# EAGLE design amc7135-20mm-dia-350mA-led-driver-mk-1.0 (EAGLE 6.5.0)
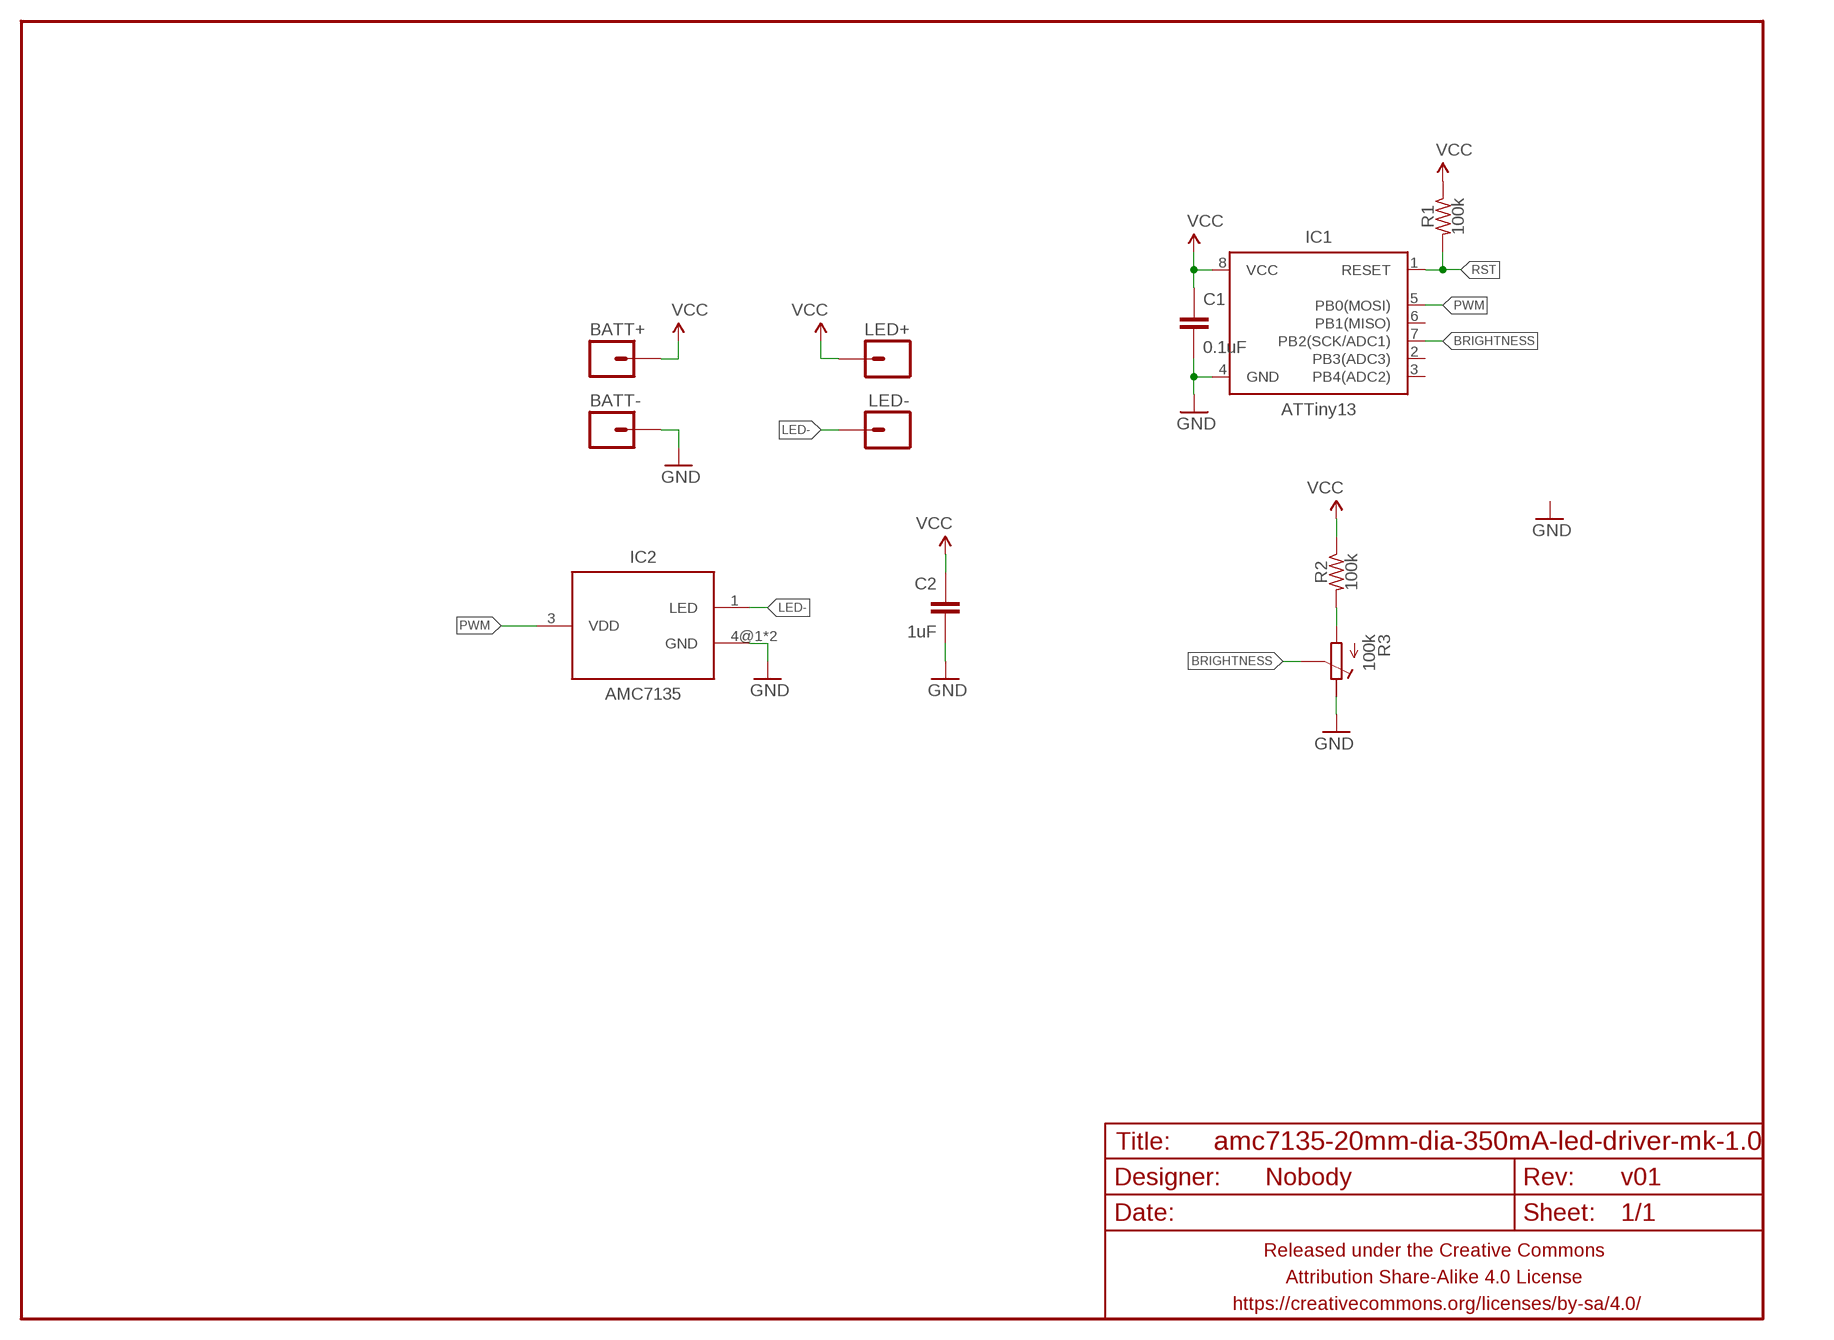
[diagram p0: schematic, sheet 1]

## Parts
BATT+  M01NOT-A-VIA-NOPE  [1X01_NOSILK_NOSTOP]
BATT-  M01NOT-A-VIA-NOPE  [1X01_NOSILK_NOSTOP]
C1  0.1uF  CAPACITOR-CERAMICC0805  [C0805]
C2  1uF  CAPACITOR-CERAMICC1206  [C1206]
FRAME1  FRAME-LETTERNO_PACKAGE  [DUMMY]
IC1  ATTiny13  ATTINY13SOIC  [SO08]
IC2  AMC7135  AMC7135SOT-89-NOTHERM  [SOT89-NOTHERM]
LED+  M01PTH-1.2MM  [1X01-1.2MM]
LED-  M01PTH-1.2MM-NS  [1X01-1.2MM-NS]
R1  100k  RESISTORR0805  [R0805]
R2  100k  RESISTORR0805  [R0805]
R3  100k  POTENTIOMETEREVM3Y  [EVM3Y]

## Nets
BRIGHTNESS: IC1.7(PB2(SCK/ADC1)) R3.S
GND: BATT-.P$1 C1.2 C2.2 IC1.4(GND) IC2.4@1(GND) IC2.4@2(GND) R3.E
LED-: IC2.1(LED) LED-.P$1
N$1: R2.2 R3.A
PWM: IC1.5(PB0(MOSI)) IC2.3(VDD)
RST: IC1.1(RESET) R1.2
VCC: BATT+.P$1 C1.1 C2.1 IC1.8(VCC) LED+.P$1 R1.1 R2.1
Unconnected: IC1.2(PB3(ADC3)) IC1.3(PB4(ADC2)) IC1.6(PB1(MISO))

## Library data of the parts
BATT+ BATT- LED+ LED- = A_butts:M01: Header 1 Standard 1-pin 0.1" header. Use with straight break away headers (SKU : PRT-00116), right angle break away headers (PRT-00553), swiss pins (PRT-00743), machine pins (PRT-00117), and female headers (PRT-00115).
C1 C2 = A_butts:CAPACITOR-CERAMIC: CAPACITOR, European symbol
FRAME1 = A_butts:FRAME-LETTER: Schematic Frame Standard 8.5x11 US Letter frame; DESIGNER: Nobody; VERSION: v01
IC1 = A_butts:ATTINY13: Atmel 8-pin 1kB flash uC
IC2 = A_butts:AMC7135
R1 R2 = A_butts:RESISTOR: RESISTOR, American symbol
R3 = A_butts:POTENTIOMETER: Trimm resistor

## Board
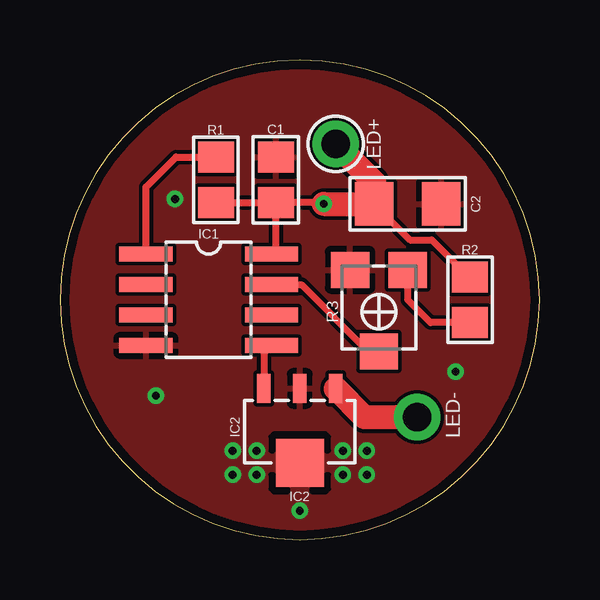
[diagram p1: board, top side]
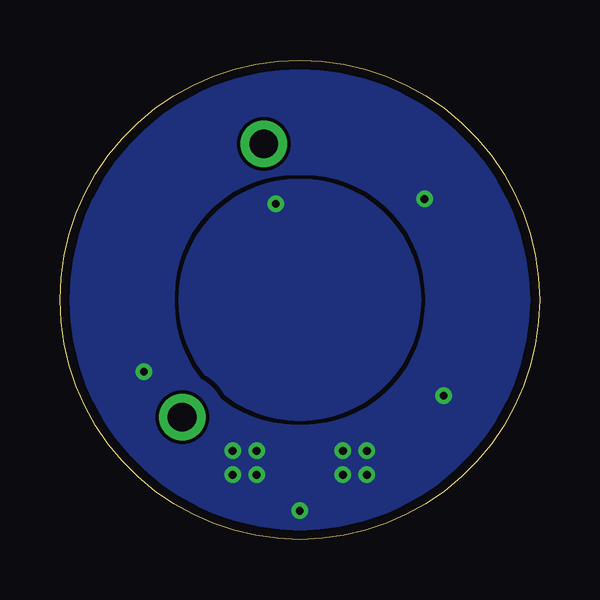
[diagram p2: board, bottom side, seen from below]

Size 20 x 20 mm. Coordinates in mm from the lower left corner, seen from the top.
Outline: 0,10 arc90 10,0 arc90 20,10 arc90 10,20 arc90 0,10
Copper layers (1*16): Top 0.0356mm / dielectric 1.5011mm / Bottom 0.0356mm
Design rules "LaenPCBOrder2": minimum track width 6mil, minimum drill 13mil, track to track 6mil, track to pad 6mil, pad to pad 6mil, via to via 6mil, smd to smd 6mil, copper to edge 15mil, drill to drill 6mil, minimum pad ring 7mil, minimum via ring 7mil, stop-mask expansion 3mil, vias tented up to drill 20mil, thermal gap 10mil
tRestrict: area 8.9,4.3 to 11.1,4.4; area 8.8,3.7 to 8.9,4.3; area 11.1,3.7 to 11.2,4.3; area 8.8,2.1 to 8.9,2.7; area 11.1,2.1 to 11.2,2.7; area 8.9,2 to 9.5,2.1; area 10.5,2 to 11.1,2.1

### Footprints (pad centres in the part's own frame; a part is rotated, then mirrored left to right if it is on the bottom)
1X01_NOSILK_NOSTOP = drill 0.33: P$1 0,0
C0805 = smd 1.3 x 1.5: 1 -0.95,0; 2 0.95,0
C1206 = smd 1.6 x 1.8: 1 -1.4,0; 2 1.4,0
SO08 = smd 0.61 x 2.21: 1 -1.905,-2.616; 2 -0.635,-2.616; 3 0.635,-2.616; 4 1.905,-2.616; 5 1.905,2.616; 6 0.635,2.616; 7 -0.635,2.616; 8 -1.905,2.616
SOT89-NOTHERM = smd 0.58 x 1.2: 1 -1.5,-1.8; 3 1.5,-1.8; 4@1 0,-1.8 | smd 2 x 2: 4@2 0,1.3
1X01-1.2MM = drill 1.2 pad 1.93: P$1 0,0
1X01-1.2MM-NS = drill 1.2 pad 1.93: P$1 0,0
R0805 = smd 1.3 x 1.5: 1 -0.95,0; 2 0.95,0
EVM3Y = smd 1.6 x 1.5: A -1.2,-1.75; E 1.2,-1.75; S 0,1.65

### Placement (x,y rotation side)
BATT+  11,14 0 top
BATT-  4.8,14.2 0 top
C1  9,15 90 top
C2  14.5,14 0 top
FRAME1  0,0 0 top
IC1  6.2,10 270 top
IC2  10,4.5 180 top
LED+  11.5,16.5 270 top
LED-  14.9,5.1 270 top
R1  6.5,15 90 top
R2  17.1,10 270 top
R3  13.3,9.5 180 top

### Tracks (layer width: path | path; a pad name or v marks a point on that pad's centre or on a via)
BRIGHTNESS
  Top 0.3: IC1.7 10.06,10.63 12.85,7.85 R3.S
GND  (via drill 0.33)
  other vias: 16.5,7 8.2,3.7 11.8,2.7 8.2,2.7 11.8,3.7 7.2,2.7 7.2,3.7 10,1.2 12.8,3.7 12.8,2.7 4,6
  pour Top (isolate 0.1): 10,0 arc-90 0,10 arc-90 10,20 arc-90 20,10 arc-90
  pour Bottom (rank 6): 0,10 arc90 10,0 arc90 20,10 arc90 10,20 arc90
LED-
  Top 1: LED-.P$1 12.7,5.1 IC2.1
N$1
  Top 0.3: R2.2 15.45,9.05 14.5,10 R3.A
PWM
  Top 0.3: IC1.5 8.5,7.78 IC2.3
RST
  Top 0.3: IC1.1 3.58,14.7 4.83,15.95 R1.2
VCC
  Top 0.3: IC1.8 9,12.02 C1.1 | R1.1 C1.1 | BATT+.P$1 10.95,14.05 C1.1 | C2.1 14.6,12.5 15.5,12.5 17.05,10.95 R2.1
  Top 1: BATT+.P$1 C2.1 13.1,14.9 LED+.P$1
  pour Bottom (isolate 1): 5,10 arc90 10,5 arc90 15,10 arc90 10,15 arc90